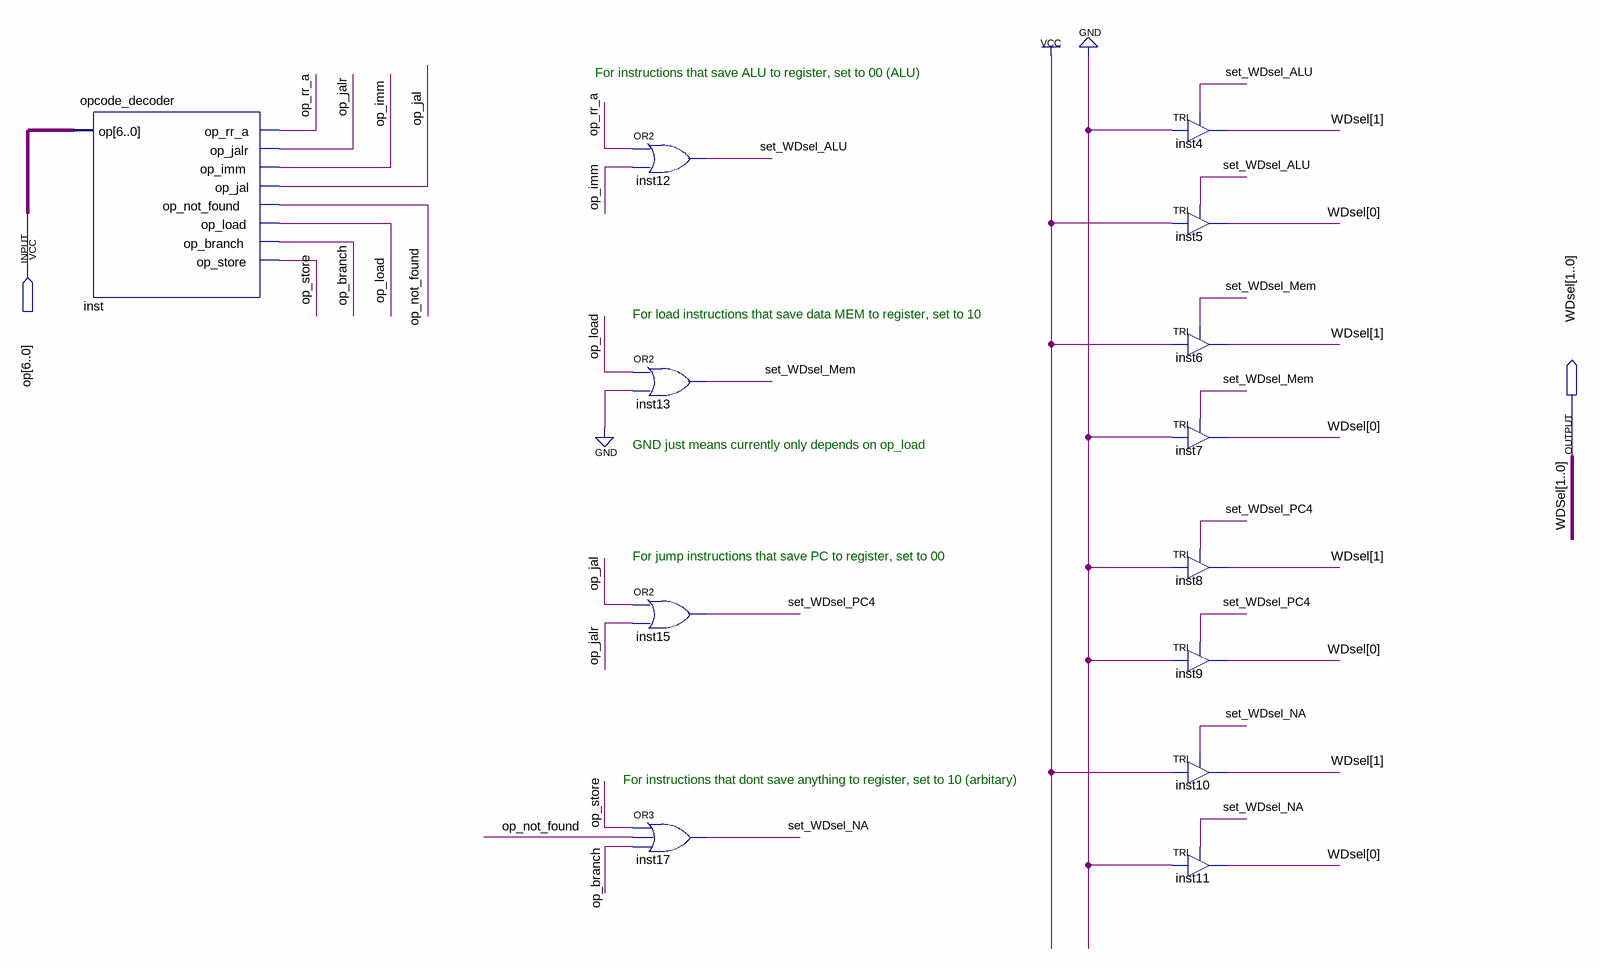
[diagram p0: schematic sheet]
// Quartus schematic WDSel_setter.bdf as structural Verilog: 13 symbols, 2 pins
module WDSel_setter (
  input  [6:0] op,
  output [1:0] WDsel
);

  wire op_branch, op_imm, op_jal, op_jalr, op_load, op_not_found, op_rr_a, op_store, set_WDsel_ALU,
       set_WDsel_Mem, set_WDsel_NA, set_WDsel_PC4;

  opcode_decoder inst (
    .op(op), .op_rr_a(op_rr_a), .op_jalr(op_jalr), .op_imm(op_imm), .op_jal(op_jal),
    .op_not_found(op_not_found), .op_load(op_load), .op_branch(op_branch), .op_store(op_store));
  or inst12 (set_WDsel_ALU, op_rr_a, op_imm);
  or inst13 (set_WDsel_Mem, op_load, 1'b0);
  or inst15 (set_WDsel_PC4, op_jal, op_jalr);
  or inst17 (set_WDsel_NA, op_store, op_not_found, op_branch);
  TRI inst4 (.IN(1'b0), .OE(set_WDsel_ALU), .OUT(WDsel[1]));
  TRI inst5 (.IN(1'b1), .OE(set_WDsel_ALU), .OUT(WDsel[0]));
  TRI inst6 (.IN(1'b1), .OE(set_WDsel_Mem), .OUT(WDsel[1]));
  TRI inst7 (.IN(1'b0), .OE(set_WDsel_Mem), .OUT(WDsel[0]));
  TRI inst8 (.IN(1'b0), .OE(set_WDsel_PC4), .OUT(WDsel[1]));
  TRI inst9 (.IN(1'b0), .OE(set_WDsel_PC4), .OUT(WDsel[0]));
  TRI inst10 (.IN(1'b1), .OE(set_WDsel_NA), .OUT(WDsel[1]));
  TRI inst11 (.IN(1'b0), .OE(set_WDsel_NA), .OUT(WDsel[0]));

  // Notes on the sheet:
  //   For instructions that save ALU to register, set to 00 (ALU)
  //   For load instructions that save data MEM to register, set to 10 
  //   GND just means currently only depends on op_load
  //   For jump instructions that save PC to register, set to 00 
  //   For instructions that dont save anything to register, set to 10 (arbitary)
endmodule
